# Altium project stepstick.PrjPcb
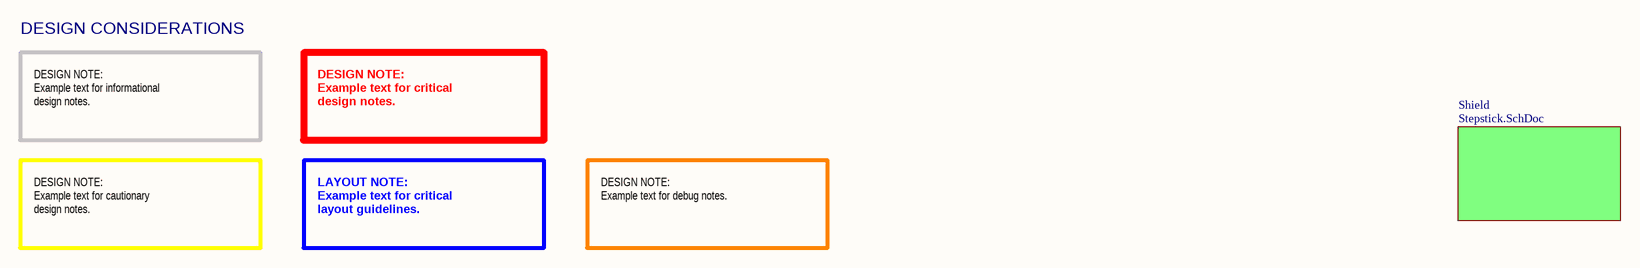
[diagram p0: CoverPage.SchDoc]
GlobalProjectRevision: 2.0; GlobalProjectName: uStepper 3D stepstick right; GlobalDrawnBy: Mogens G Nicolaisen; GlobalCompanyName: ON Development IVS
2 sheets, 3 parts. Net scope: global (net labels, ports and power ports of the same name join across sheets).
Board file: stepstick.PcbDoc
Sheets:
  CoverPage.SchDoc
    Shield = Stepstick.SchDoc

## Sheet CoverPage.SchDoc: =GlobalProjectName
size A3; DocumentNumber: 1; SheetNumber: 1; SheetTotal: 2

### Sub-sheets
Shield = Stepstick.SchDoc: no entries

### Notes on the sheet
- DESIGN CONSIDERATIONS
- DESIGN NOTE:
  Example text for informational
  design notes.
- DESIGN NOTE:
  Example text for critical
  design notes.
- DESIGN NOTE:
  Example text for cautionary
  design notes.
- LAYOUT NOTE:
  Example text for critical
  layout guidelines.
- DESIGN NOTE:
  Example text for debug notes.
- ON Development IVS
- Title:
- Size:
- A3
- Drawn By:
- Date:
- Sheet
- of
- Revision:

## Sheet Stepstick.SchDoc: =GlobalProjectName
size A3; SheetNumber: 2; SheetTotal: 2
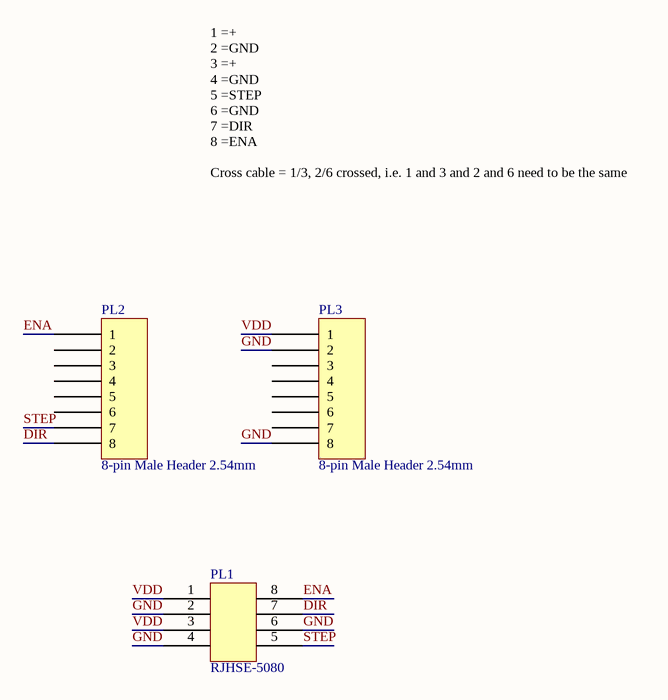
[diagram p1: Stepstick.SchDoc]

### Parts
PL1  RJHSE-5080  [AMPHENOL RJHSE-5080]
PL2  8-pin Male Header 2.54mm  [8-pin 2.54mm header]
PL3  8-pin Male Header 2.54mm  [8-pin 2.54mm header]

### Nets
DIR: PL1.7 PL2.8
ENA: PL1.8 PL2.1
GND: PL1.2 PL1.4 PL1.6 PL3.2 PL3.8
STEP: PL1.5 PL2.7
VDD: PL1.1 PL1.3 PL3.1

Not connected (* = marked no-connect by the designer): PL2 2 3 4 5 6; PL3 3 4 5 6 7

### Notes on the sheet
- 1 =+
  2 =GND
  3 =+
  4 =GND
  5 =STEP
  6 =GND
  7 =DIR
  8 =ENA
  Cross cable = 1/3, 2/6 crossed, i.e. 1 and 3 and 2 and 6 need to be the same
- ON Development IVS
- Title:
- Size:
- A3
- Drawn By:
- Date:
- Sheet
- of
- Revision:

### Library data of the parts
PL1 = CMP-003-0022-0.1: CONN MOD JACK 8P8C R/A UNSHLD; Shielding: Unshielded; Gender: Female; Current Rating: 1.5A; Voltage Rating: 125V; Contact Resistance: 20mR; Connector Type: Jack, RJ45; Number of Ports: 1; Direction: Up; Number of Contacts: 8; Pitch: 2.03mm; Mount: Panel, Through Hole; Contact Plating: Gold; Contact Material: Bronze; Colour: Black; Housing Material: Thermoplastic; Min Operating Temperature: -55°C; Max Operating Temperature: 85°C; Package Quantity: 36; Number of Rows: 1; Packaging: Tray; Max Current Rating: 1.5A; Termination: Solder; Number of Positions Loaded: 8; Max Voltage Rating (AC): 125V; Number of Positions: 8; Orientation: Right Angle; Voltage Rating (DC): 125V; Length: 15.75mm; Depth: 14.99mm; Radiation Hardening: No; REACH SVHC: Unknown; Lead Free: Lead Free; Flammability Rating: UL94 V-0
PL2 PL3 = CMP-003-0009-0.3: 8 Positions Header Connector 0.100" (2.54mm) Through Hole Gold